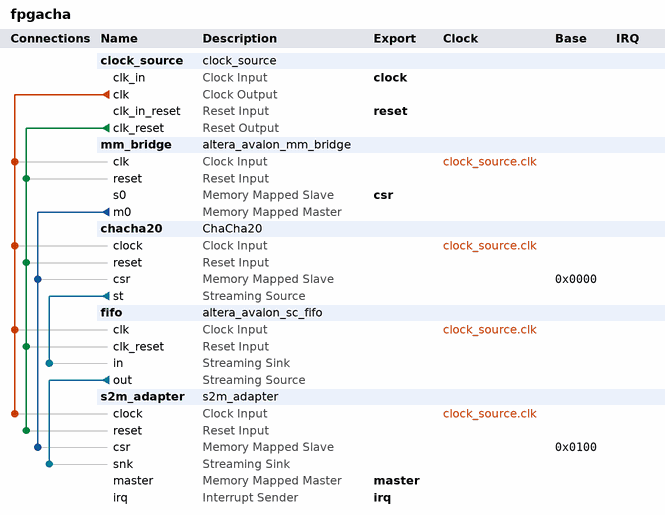
[diagram p0: system contents]
# Platform Designer (Qsys) system fpgacha, Cyclone V 5CSEMA5F31C6
# Parameters at their usual value, and those the tool derives, are not listed.
package require -exact qsys 18.1
create_system fpgacha
set_project_property DEVICE_FAMILY {Cyclone V}
set_project_property DEVICE 5CSEMA5F31C6

add_instance clock_source clock_source 18.1
set_instance_parameter_value clock_source clockFrequency 50000000

add_instance mm_bridge altera_avalon_mm_bridge 18.1
set_instance_parameter_value mm_bridge ADDRESS_UNITS SYMBOLS
set_instance_parameter_value mm_bridge ADDRESS_WIDTH 10
set_instance_parameter_value mm_bridge DATA_WIDTH 32
set_instance_parameter_value mm_bridge MAX_PENDING_RESPONSES 4
set_instance_parameter_value mm_bridge USE_AUTO_ADDRESS_WIDTH 0

add_instance chacha20 ChaCha20 1.0

add_instance fifo altera_avalon_sc_fifo 18.1
set_instance_parameter_value fifo BITS_PER_SYMBOL 512
set_instance_parameter_value fifo CHANNEL_WIDTH 0
set_instance_parameter_value fifo ERROR_WIDTH 0
set_instance_parameter_value fifo FIFO_DEPTH 16
set_instance_parameter_value fifo USE_FILL_LEVEL 0
set_instance_parameter_value fifo USE_MEMORY_BLOCKS 1
set_instance_parameter_value fifo USE_STORE_FORWARD 0

add_instance s2m_adapter s2m_adapter 1.0

# connections
add_connection clock_source.clk chacha20.clock clock
add_connection clock_source.clk fifo.clk clock
add_connection clock_source.clk mm_bridge.clk clock
add_connection clock_source.clk s2m_adapter.clock clock
add_connection clock_source.clk_reset chacha20.reset reset
add_connection clock_source.clk_reset fifo.clk_reset reset
add_connection clock_source.clk_reset mm_bridge.reset reset
add_connection clock_source.clk_reset s2m_adapter.reset reset
add_connection mm_bridge.m0 chacha20.csr avalon
set_connection_parameter_value mm_bridge.m0/chacha20.csr baseAddress 0x0000
add_connection mm_bridge.m0 s2m_adapter.csr avalon
set_connection_parameter_value mm_bridge.m0/s2m_adapter.csr baseAddress 0x0100
add_connection chacha20.st fifo.in avalon_streaming
add_connection fifo.out s2m_adapter.snk avalon_streaming

# exported interfaces
add_interface clock clock sink
set_interface_property clock EXPORT_OF clock_source.clk_in
add_interface csr avalon slave
set_interface_property csr EXPORT_OF mm_bridge.s0
add_interface irq interrupt sender
set_interface_property irq EXPORT_OF s2m_adapter.irq
add_interface master avalon master
set_interface_property master EXPORT_OF s2m_adapter.master
add_interface reset reset sink
set_interface_property reset EXPORT_OF clock_source.clk_in_reset

set_interconnect_requirement {$system} qsys_mm.clockCrossingAdapter HANDSHAKE
set_interconnect_requirement {$system} qsys_mm.enableEccProtection FALSE
set_interconnect_requirement {$system} qsys_mm.insertDefaultSlave FALSE
set_interconnect_requirement {$system} qsys_mm.maxAdditionalLatency 1

save_system fpgacha.qsys
